# Altium schematic sheet PSRAM.SchDoc: PSRAM
size A4; Author: N.P; CompanyName: STMicroelectronics; Organization: MCD/APPLIS/LMS; DocumentNumber: MB1260; SheetNumber: 6; SheetTotal: 13; Project: STM32F723e-DISCO
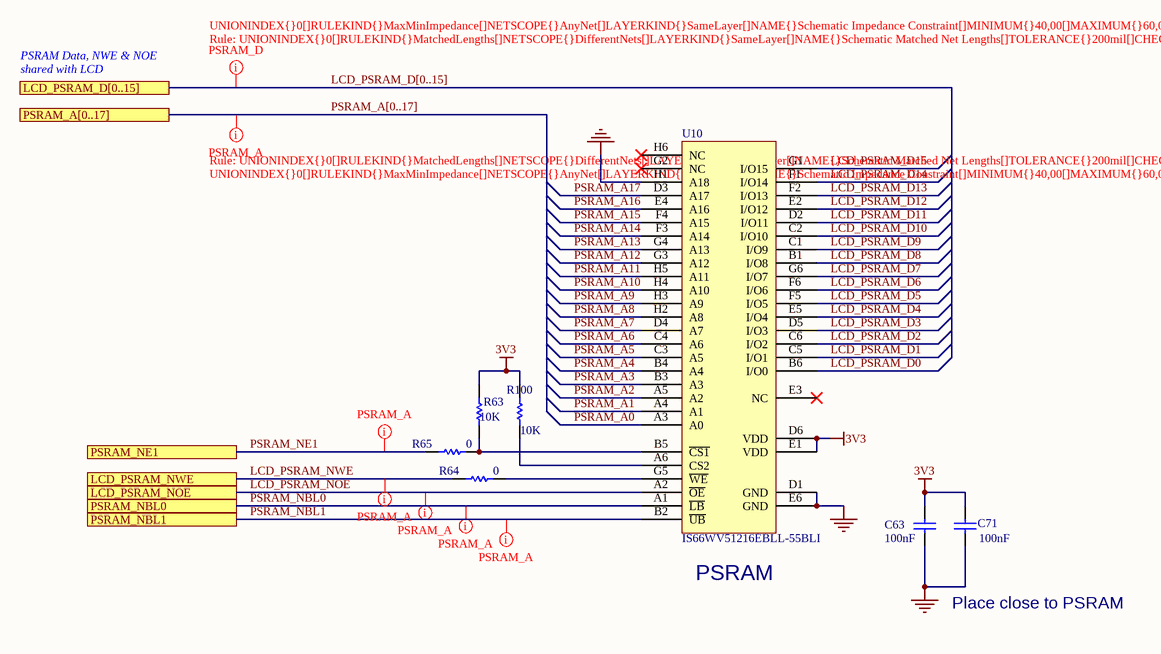
[diagram p0: PSRAM.SchDoc]

## Parts
C63  100nF  [0402C]
C71  100nF  [0402C]
R63  value 10K  [0603R]  (hidden comment: 10K_1%_0603)
R64  value 0  [0603R-GS]  (hidden comment: 0_5%_0603)
R65  value 0  [0603R-GS]  (hidden comment: 0_5%_0603)
R100  value 10K  [0603R]  (hidden comment: 10K_1%_0603)
U10  IS66WV51216EBLL-55BLI  [FBGA48_0R75_6X8]

## Ports
LCD_PSRAM_D[0..15], LCD_PSRAM_NOE, LCD_PSRAM_NWE, PSRAM_A[0..17], PSRAM_NBL0, PSRAM_NBL1, PSRAM_NE1

## Nets
3V3: C63.2 C71.2 R63.2 R100.2 U10.D6(VDD) U10.E1(VDD)
GND: C63.1 C71.1 U10.D1(GND) U10.E6(GND) U10.H1(A18)
LCD_PSRAM_D0: U10.B6(I/O0)
LCD_PSRAM_D1: U10.C5(I/O1)
LCD_PSRAM_D2: U10.C6(I/O2)
LCD_PSRAM_D3: U10.D5(I/O3)
LCD_PSRAM_D4: U10.E5(I/O4)
LCD_PSRAM_D5: U10.F5(I/O5)
LCD_PSRAM_D6: U10.F6(I/O6)
LCD_PSRAM_D7: U10.G6(I/O7)
LCD_PSRAM_D8: U10.B1(I/O8)
LCD_PSRAM_D9: U10.C1(I/O9)
LCD_PSRAM_D10: U10.C2(I/O10)
LCD_PSRAM_D11: U10.D2(I/O11)
LCD_PSRAM_D12: U10.E2(I/O12)
LCD_PSRAM_D13: U10.F2(I/O13)
LCD_PSRAM_D14: U10.F1(I/O14)
LCD_PSRAM_D15: U10.G1(I/O15)
LCD_PSRAM_NOE: U10.A2(~{OE}) ; port LCD_PSRAM_NOE
LCD_PSRAM_NWE: R64.1 ; port LCD_PSRAM_NWE
PSRAM_A0: U10.A3(A0)
PSRAM_A1: U10.A4(A1)
PSRAM_A2: U10.A5(A2)
PSRAM_A3: U10.B3(A3)
PSRAM_A4: U10.B4(A4)
PSRAM_A5: U10.C3(A5)
PSRAM_A6: U10.C4(A6)
PSRAM_A7: U10.D4(A7)
PSRAM_A8: U10.H2(A8)
PSRAM_A9: U10.H3(A9)
PSRAM_A10: U10.H4(A10)
PSRAM_A11: U10.H5(A11)
PSRAM_A12: U10.G3(A12)
PSRAM_A13: U10.G4(A13)
PSRAM_A14: U10.F3(A14)
PSRAM_A15: U10.F4(A15)
PSRAM_A16: U10.E4(A16)
PSRAM_A17: U10.D3(A17)
PSRAM_NBL0: U10.A1(~{LB}) ; port PSRAM_NBL0
PSRAM_NBL1: U10.B2(~{UB}) ; port PSRAM_NBL1
PSRAM_NE1: R65.1 ; port PSRAM_NE1
NetR63_1: R63.1 R65.2 U10.B5(~{CS1})
NetR64_2: R64.2 U10.G5(~{WE})
NetR100_1: R100.1 U10.A6(CS2)

Not connected (* = marked no-connect by the designer): U10 E3(NC)* G2(NC)* H6(NC)*

## Buses and harness runs
bus LCD_PSRAM_D[0..15] = port LCD_PSRAM_D[0..15]
bus PSRAM_A[0..17] = port PSRAM_A[0..17]

## Layout directives
rule Matched Net Lengths [Tolerance = 200mil]; rule Impedance Constraint [Min = 40.00    Max = 60.00    ]: (no net found under the mark), LCD_PSRAM_NOE, LCD_PSRAM_NWE, PSRAM_NBL0, PSRAM_NBL1, PSRAM_NE1

## Notes on the sheet
- PSRAM Data, NWE & NOE shared with LCD
- (near U10) PSRAM
- Place close to PSRAM
- Title:
- Project:
- Size:
- Revision:
- Variant:
- A4
- -
- Date:
- Reference:
- Sheet:
- of

## Library data of the parts
C63 C71 = Cap_100nF_X7R_10%_0402: Capacitor,100nF,16V,X7R,10%,0402,YAGEO; Manuf_Part_1: CC0402KRX7R7BB104; Ordered by: Subcon; Fitted: YES; Revision: July-2002: Re-released for DXP Platform.; Value: 100nF; Order: CC0402KRX7R7BB104; Manuf_1: YAGEO; ECCN_US/EU: n/a
R63 R100 = Res_10K_1%_0603: Resistor,10K,0603,1%,YAGEO; Manuf_Part_1: RC0603FR-0710KL; Ordered by: Subcon; Fitted: YES; Manuf_1: YAGEO; Order: RC0603FR-0710KL; ECCN_US/EU: n/a
R64 R65 = Res_0_5%_0603: Resistor,0,0603,5%,YAGEO; Manuf_Part_1: RC0603JR-070RL; Order: 2363481; Ordered by: Subcon; Fitted: YES; ECCN_US/EU: n/a; Manuf_1: YAGEO; Distrib: FARNELL
U10 = IS66WV51216EBLL-55BLI: IC SRAM 8MBIT 55NS 48MINIBGA 6mm x 8mm; Manuf_1: ISSI, Integrated Silicon Solution Inc; Fitted: YES; Ordered_By: Subcon; Manuf_Part_1: IS66WV51216EBLL-55BLI; Value: IS66WV51216EBLL-55BLI; ECCN_US/EU: n/a; Distrib: *; Order_Code: *; Ordered by: Subcon